# EAGLE design usb2serial (EAGLE 6.4)
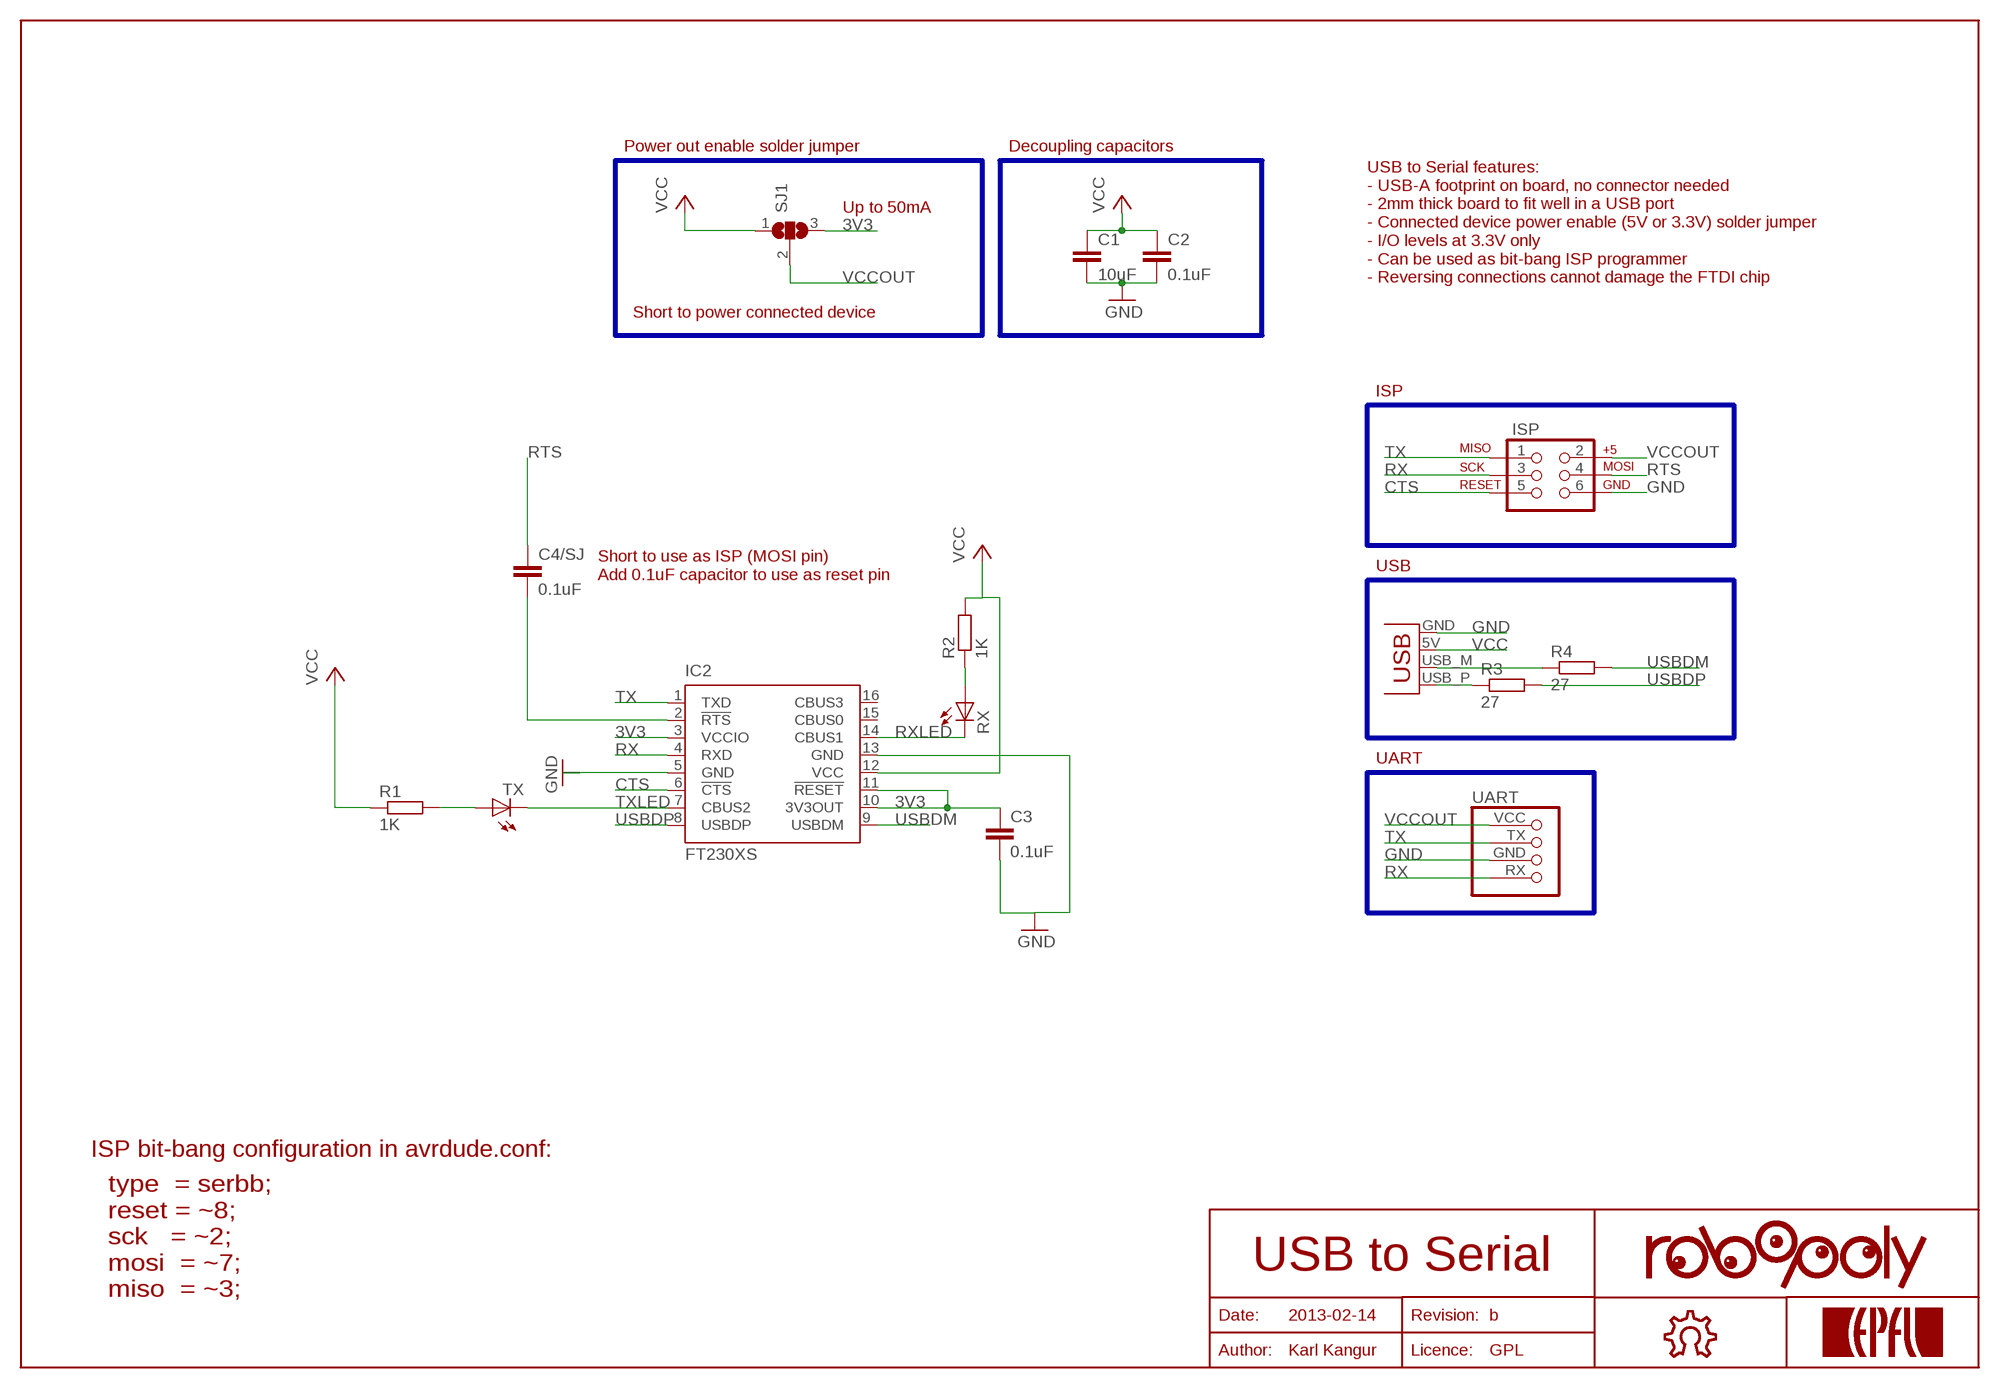
[diagram p0: schematic, sheet 1]

## Parts
C1  10uF  C-EUC0805  [C0805]
C2  0.1uF  C-EUC0805  [C0805]
C3  0.1uF  C-EUC0805  [C0805]
C4/SJ  0.1uF  C-EUC0805  [C0805]
IC2  FT230XS  [SSOP16]
ISP  ISP-6PIN  [2X3]
JP1  USBPCB  [USB-A-PCB]
R1  1K  R-EU_R0805  [R0805]
R2  1K  R-EU_R0805  [R0805]
R3  27  R-EU_R0805  [R0805]
R4  27  R-EU_R0805  [R0805]
RX  LEDCHIPLED_0805  [CHIPLED_0805]
SJ1  SJ2W  [SJ_2]
TX  LEDCHIPLED_0805  [CHIPLED_0805]
U$1  UART-ROBOPOLY90  [929835-01-04-RK]
U$2  ROBOPOLY-LOGOBOTTOM  [ROBOPOLY-LOGO-BOTTOM]
U$3  OPEN-HARDWARE-LOGOBOTTOM-SMALL  [OPEN-HARDWARE-BOTTOM-SMALL]

## Nets
3V3: C3.1 IC2.3(VCCIO) IC2.10(3V3OUT) IC2.11(!RESET) SJ1.3
CTS: IC2.6(!CTS) ISP.5
GND: C1.2 C2.2 C3.2 IC2.5(GND) IC2.13(GND) ISP.6 JP1.GND U$1.GND
N$1: JP1.USB_M(D-) R4.1
N$2: R1.2 TX.A
N$3: C4/SJ.2 IC2.2(!RTS)
N$4: R2.1 RX.A
N$6: JP1.USB_P(D+) R3.1
RTS: C4/SJ.1 ISP.4
RX: IC2.4(RXD) ISP.3 U$1.RX
RXLED: IC2.14(CBUS1) RX.C
TX: IC2.1(TXD) ISP.1 U$1.TX
TXLED: IC2.7(CBUS2) TX.C
USBDM: IC2.9(USBDM) R4.2
USBDP: IC2.8(USBDP) R3.2
VCC: C1.1 C2.1 IC2.12(VCC) JP1.5V(VBUS) R1.1 R2.2 SJ1.1
VCCOUT: ISP.2 SJ1.2 U$1.VCC
Unconnected: IC2.15(CBUS0) IC2.16(CBUS3)

## Buses
B$2
B$3
B$4
B$5
B$6

## Notes on the sheet
- Power out enable solder jumper | Decoupling capacitors
- USB to Serial features:
  - USB-A footprint on board, no connector needed
  - 2mm thick board to fit well in a USB port
  - Connected device power enable (5V or 3.3V) solder jumper
  - I/O levels at 3.3V only
  - Can be used as bit-bang ISP programmer
  - Reversing connections cannot damage the FTDI chip
- Up to 50mA
- Short to power connected device
- ISP
- USB
- Short to use as ISP (MOSI pin)
  Add 0.1uF capacitor to use as reset pin
- UART
- ISP bit-bang configuration in avrdude.conf:
- type  = serbb;
  reset = ~8;
  sck   = ~2;
  mosi  = ~7;
  miso  = ~3;
- USB to Serial
- Date: | 2013-02-14 | Revision: | b
- Author: | Karl Kangur | Licence: | GPL

## Library data of the parts
C1-C3 C4/SJ = rcl:C-EU: CAPACITOR, European symbol
IC2 = ftdichip:FT230X: USB to BASIC UART IC Auto generated by make-symbol-device-package-bsdl.ulp Rev. 43 Source: Data sheet <http://www.ftdichip.com/Support/Documents/DataSheets/ICs/DS_FT230X.pdf>
ISP = karl:ISP-6PIN: AVR ISP 6 Pin This is the reduced ISP connector for AVR programming. Common on Arduino. This footprint will take up less PCB space and can be used with a 10-pin to 6-pin adapter.
JP1 = SparkFun-Connectors:USB: USB Connectors USB-B-PTH is fully proven SKU : PRT-00139/CONN-08278 USB-miniB is fully proven SKU : PRT-00587 USB-A-PCB is untested. USB-A-H is throughly reviewed, but untested. Spark Fun Electronics SKU : PRT-00437 USB-B-SMT is throughly reviewed, but untested. Needs silkscreen touching up. USB-A-S has not been used/tested USB-MB-H has not been used/tested USB-MICROB has been used. CONN-09505
R1-R4 = rcl:R-EU_: RESISTOR, European symbol
RX TX = led:LED: LED OSRAM: - CHIPLED LG R971, LG N971, LY N971, LG Q971, LY Q971, LO R971, LY R971 LH N974, LH R974 LS Q976, LO Q976, LY Q976 LO Q996 - Hyper CHIPLED LW Q18S LB Q993, LB Q99A, LB R99A - SideLED LS A670, LO A670, LY A670, LG A670, LP A670 LB A673, LV A673, LT A673, LW A673 LH A674 LY A675 LS A676, LA A676, LO A676, LY A676, LW A676 LS A679, LY A679, LG A679 - Hyper Micro SIDELED® LS Y876, LA Y876, LO Y876, LY Y876 LT Y87S - SmartLED LW L88C, LW L88S LB L89C, LB L89S, LG L890 LS L89K, LO L89K, LY L89K LS L896, LA L896, LO L896, LY L896 - TOPLED LS T670, LO T670, LY T670, LG T670, LP T670 LSG T670, LSP T670, LSY T670, LOP T670, LYG T670 LG T671, LOG T671, LSG T671 LB T673, LV T673, LT T673, LW T673 LH T674 LS T676, LA T676, LO T676, LY T676, LB T676, LH T676, LSB T676, LW T676 LB T67C, LV T67C, LT T67C, LS T67K, LO T67K, LY T67K, LW E67C LS E67B, LA E67B, LO E67B, LY E67B, LB E67C, LV E67C, LT E67C LW T67C LS T679, LY T679, LG T679 LS T770, LO T770, LY T770, LG T770, LP T770 LB T773, LV T773, LT T773, LW T773 LH T774 LS E675, LA E675, LY E675, LS T675 LS T776, LA T776, LO T776, LY T776, LB T776 LHGB T686 LT T68C, LB T68C - Hyper Mini TOPLED® LB M676 - Mini TOPLED Santana® LG M470 LS M47K, LO M47K, LY M47K Source: http://www.osram.convergy.de LUXEON: - LUMILED® LXK2-PW12-R00, LXK2-PW12-S00, LXK2-PW14-U00, LXK2-PW14-V00 LXK2-PM12-R00, LXK2-PM12-S00, LXK2-PM14-U00 LXK2-PE12-Q00, LXK2-PE12-R00, LXK2-PE12-S00, LXK2-PE14-T00, LXK2-PE14-U00 LXK2-PB12-K00, LXK2-PB12-L00, LXK2-PB12-M00, LXK2-PB14-N00, LXK2-PB14-P00, LXK2-PB14-Q00 LXK2-PR12-L00, LXK2-PR12-M00, LXK2-PR14-Q00, LXK2-PR14-R00 LXK2-PD12-Q00, LXK2-PD12-R00, LXK2-PD12-S00 LXK2-PH12-R00, LXK2-PH12-S00 LXK2-PL12-P00, LXK2-PL12-Q00, LXK2-PL12-R00 Source: www.luxeon.com KINGBRIGHT: KA-3528ASYC Source: www.kingbright.com
SJ1 = jumper:SJ2W: SMD solder JUMPER
U$1 = karl:UART-ROBOPOLY
U$2 = karl:ROBOPOLY-LOGO
U$3 = karl:OPEN-HARDWARE-LOGO

## Board
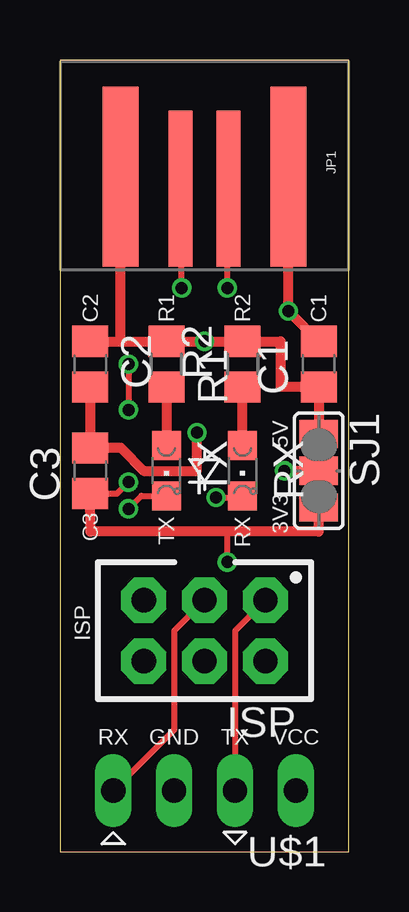
[diagram p1: board, top side]
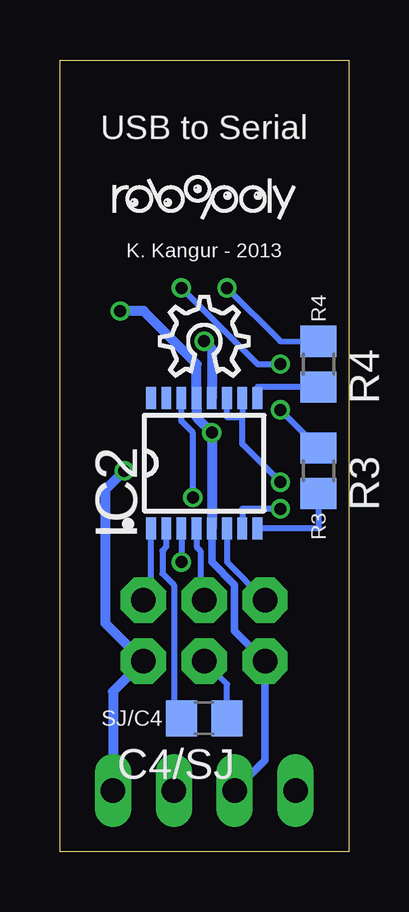
[diagram p2: board, bottom side, seen from below]

Size 12.05 x 33 mm. Coordinates in mm from the lower left corner, seen from the top.
Outline: 0,0 12.05,0 12.05,33 0,33 0,0
Copper layers (1*16): Top 0.035mm / dielectric 1.5mm / Bottom 0.035mm
Design rules "Fusion_eagle_rule_v1.1 *": minimum track width 6mil, minimum drill 12mil, track to track 6mil, track to pad 6mil, pad to pad 6mil, via to via 6mil, smd to smd 0mil, copper to edge 10mil, drill to drill 10mil, minimum pad ring 10mil, minimum via ring 6mil, stop-mask expansion 2mil, vias tented up to drill 100mil, thermal gap 10mil

### Footprints (pad centres in the part's own frame; a part is rotated, then mirrored left to right if it is on the bottom)
C0805 = smd 1.3 x 1.5: 1 -0.95,0; 2 0.95,0
SSOP16 = smd 0.914 x 0.406: 1 -2.718,2.223; 2 -2.718,1.587; 3 -2.718,0.953; 4 -2.718,0.318; 5 -2.718,-0.318; 6 -2.718,-0.953; 7 -2.718,-1.587; 8 -2.718,-2.223; 9 2.718,-2.223; 10 2.718,-1.587; 11 2.718,-0.953; 12 2.718,-0.318; 13 2.718,0.318; 14 2.718,0.953; 15 2.718,1.587; 16 2.718,2.223
2X3 = drill 1.016 pad 1.88 octagon: 1 -2.54,-1.27; 2 -2.54,1.27; 3 0,-1.27; 4 0,1.27; 5 2.54,-1.27; 6 2.54,1.27
USB-A-PCB = smd 7.5 x 1.5: 5V -0.2,-3.5; GND -0.2,3.5 | smd 6.5 x 1: USB_M 0.3,-1; USB_P 0.3,1
R0805 = smd 1.3 x 1.5: 1 -0.95,0; 2 0.95,0
CHIPLED_0805 = smd 1.2 x 1.2: A 0,-1.05; C 0,1.05
SJ_2 = smd 1.168 x 1.6: 1 -1.524,0; 2 0,0; 3 1.524,0
929835-01-04-RK = drill 1.016 long: GND 1.27,0; RX 3.81,0; TX -1.27,0; VCC -3.81,0

### Placement (x,y rotation side)
C1  10.79,20.32 90 top
C2  1.27,20.32 270 top
C3  1.27,15.88 90 top
C4/SJ  6.03,5.56 180 bottom
IC2  6.03,16.19 90 bottom
ISP  6.03,9.21 180 top
JP1  6.03,27.94 270 top
R1  4.45,20.32 270 top
R2  7.62,20.32 90 top
R3  1.27,15.88 270 bottom
R4  1.27,20.32 270 bottom
RX  7.62,15.88 180 top
SJ1  10.79,15.88 270 top
TX  4.45,15.88 180 top
U$1  6.03,2.54 180 top
U$2  6.03,26.35 0 top
U$3  6.03,21.27 0 top

### Tracks (layer width: path | path; a pad name or v marks a point on that pad's centre or on a via)
3V3  (via drill 0.5)
  Top 0.254: C3.1 2.38,14.92 v2.86,15.4 | v6.99,12.06 6.99,13.34
  Top 0.406: C3.1 1.27,13.34 6.99,13.34 10.79,13.34 SJ1.3
  Bottom 0.254: IC2.10 4.45,18.1 | 4.45,18.1 5.08,18.1 IC2.11 | v2.86,15.4 4.45,16.99 4.45,18.1 | IC2.3 v6.99,12.06
CTS
  Bottom 0.254: IC2.6 5.08,12.06 ISP.5
GND  (via drill 0.5)
  Top 0.406: C1.2 v9.53,22.53 JP1.GND | C2.2 C3.2 2.54,16.82 3.49,15.88 5.71,15.88 v5.71,17.46
  Bottom 0.305: IC2.5 5.71,12.06 4.76,11.11 4.76,9.21 ISP.6 3.49,3.81 U$1.GND
  Bottom 0.406: v9.53,22.53 8.56,22.53 6.35,20.32 IC2.13 6.35,18.1 v5.71,17.46 IC2.5
N$1  (via drill 0.5)
  Top 0.254: v5.08,23.5 5.08,27.64 JP1.USB_M
  Bottom 0.254: v5.08,23.5 2.86,21.27 R4.1
N$2
  Top 0.406: R1.2 TX.A
N$3
  Bottom 0.254: IC2.2 7.62,12.7 7.78,12.54 7.78,11.59 7.3,11.11 7.3,5.56 C4/SJ.2
N$4
  Top 0.406: RX.A R2.1
N$6  (via drill 0.5)
  Top 0.254: v2.86,20.32 v2.86,18.41 | v6.99,23.5 6.99,27.64 JP1.USB_P
  Bottom 0.254: v6.99,23.5 3.81,20.32 v2.86,20.32 | v2.86,18.41 R3.1
RTS
  Bottom 0.254: C4/SJ.1 5.08,6.99 ISP.4
RX
  Top 0.254: ISP.3 4.76,9.21 4.76,5.08 U$1.RX
  Bottom 0.254: ISP.3 6.19,10.64 6.19,12.54 6.35,12.7 IC2.4
RXLED  (via drill 0.5)
  Top 0.254: v6.51,14.76 7.62,14.76 RX.C
  Bottom 0.254: v6.51,14.76 6.51,17.46 6.99,17.94 IC2.14
TX
  Top 0.254: ISP.1 7.3,9.21 U$1.TX
  Bottom 0.254: ISP.1 8.26,10.79 IC2.1
TXLED  (via drill 0.5)
  Top 0.254: v2.86,14.29 3.4,14.82 TX.C
  Bottom 0.254: v2.86,14.29 4.45,14.29 IC2.7
USBDM
  Bottom 0.254: R4.2 3.81,19.37 IC2.9
USBDP
  Bottom 0.254: R3.2 1.27,13.47 IC2.8
VCC  (via drill 0.5)
  Top 0.406: C2.1 2.53,21.27 | 2.53,21.27 JP1.5V | 2.53,21.27 R1.1 | R1.1 R2.2 9.21,21.27 9.21,19.37 C1.1 SJ1.1 | R1.1 v6.03,21.27
  Bottom 0.406: v6.03,21.27 5.71,20.95 IC2.12
VCCOUT  (via drill 0.5)
  Top 0.406: SJ1.2 v9.37,15.88
  Bottom 0.406: U$1.VCC 9.84,6.67 ISP.2 10.16,9.53 10.16,15.08 v9.37,15.88

### Text on the board
tPlace: C2 | R1 | R2 | C1 | 5V | 3V3 | C3 | TX | RX | ISP | RX | GND | TX | VCC
bPlace: USB to Serial | K. Kangur - 2013 | R4 | R3 | SJ/C4